# EasyEDA schematic ESP32 Battery Test Dec 2025.json
TITLE: Sheet_1; REV: 1.0; Date: 2025-11-22; Sheet: 1/1; Drawn By: capyvara0; Company: Your Company
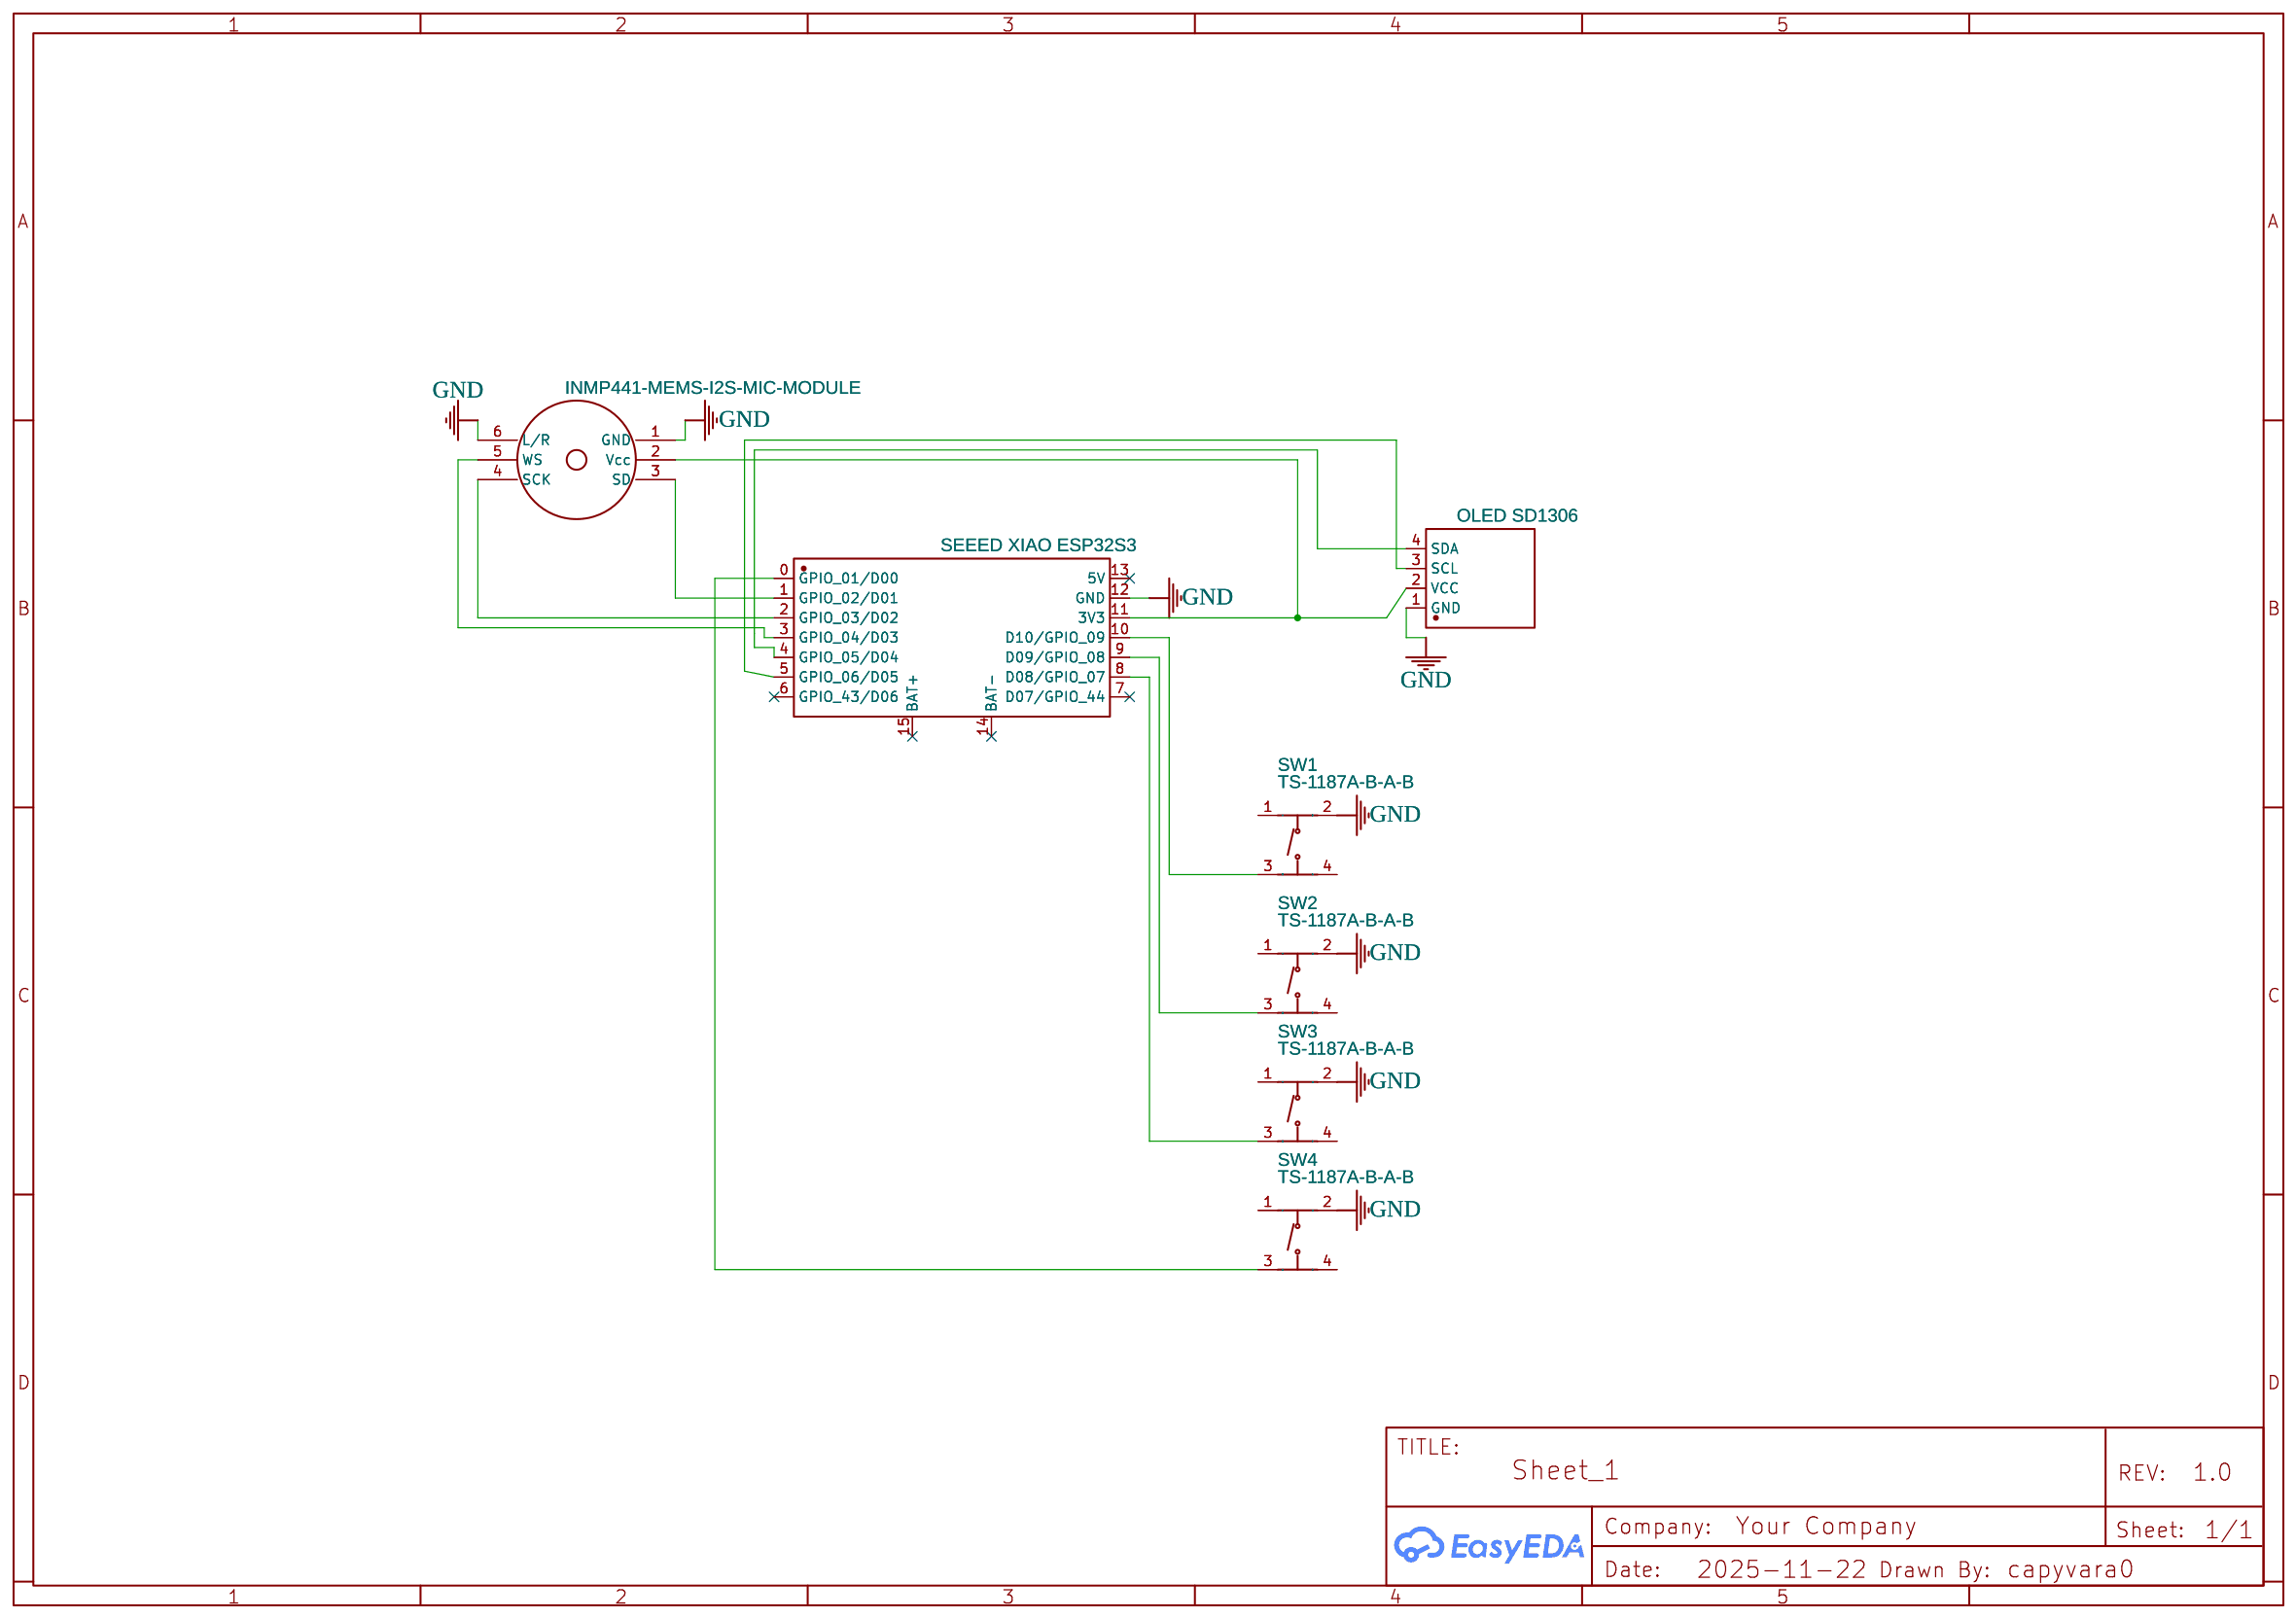
[diagram p0: schematic sheet]

## Parts
SW1  TS-1187A-B-A-B  [SW-SMD_4P-L5.1-W5.1-P3.70-LS6.5-TL_H1.5]
SW2  TS-1187A-B-A-B  [SW-SMD_4P-L5.1-W5.1-P3.70-LS6.5-TL_H1.5]
SW3  TS-1187A-B-A-B  [SW-SMD_4P-L5.1-W5.1-P3.70-LS6.5-TL_H1.5]
SW4  TS-1187A-B-A-B  [SW-SMD_4P-L5.1-W5.1-P3.70-LS6.5-TL_H1.5]
U1  SEEED XIAO ESP32S3  [SEEED STUDIO XIAO_S3 BY LAURENT]
U2  INMP441-MEMS-I2S-MIC-MODULE  [INMP441-MEMS-I2S-MIC-MODULE]
U4  OLED SD1306  [OLED-TH12864]

## Library data of the parts
SW1-SW4 = TS-1187A-B-A-B: Contributor: LCSC; Supplier: LCSC; Supplier Part: C318884; Manufacturer: XKB Connection(中国星坤); JLCPCB Part Class: Basic Part
U1 = SEEED XIAO ESP32S3: Manufacturer: Seeeduino; Manufacturer Part: Xiao; Supplier: Amazon; Contributor: Robert Błaszczak
U2 = INMP441-MEMS-I2S-MIC-MODULE: Supplier: ebay; link: https://www.ebay.de/itm/174127178542; Contributor: fcuce216
U4 = OLED SD1306: Supplier: LCSC; Supplier Part: C9900014198; Manufacturer: null; Manufacturer Part: 1.3寸OLED显示屏12864; link: https://atta.szlcsc.comnull; JLCPCB Part Class: Extended Part; Contributor: Yanko Andrade

## Nets
GND: SW1.2(B) SW2.2(B) SW3.2(B) SW4.2(B) U1.12(GND) U2.1(GND) U2.6(L/R) U4.1(GND)
Net-(SW1-3): SW1.3(C) U1.10(D10/GPIO 09)
Net-(SW2-3): SW2.3(C) U1.9(D09/GPIO 08)
Net-(SW3-3): SW3.3(C) U1.8(D08/GPIO 07)
Net-(SW4-3): SW4.3(C) U1.0(GPIO 01/D00)
Net-(U1-1): U1.1(GPIO 02/D01) U2.3(SD)
Net-(U1-2): U1.2(GPIO 03/D02) U2.4(SCK)
Net-(U1-3): U1.3(GPIO 04/D03) U2.5(WS)
Net-(U1-4): U1.4(GPIO 05/D04) U4.4(SDA)
Net-(U1-5): U1.5(GPIO 06/D05) U4.3(SCL)
Net-(U1-11): U1.11(3V3) U2.2(Vcc) U4.2(VCC)

Not connected (* = marked no-connect by the designer): SW1 1(A) 4(D); SW2 1(A) 4(D); SW3 1(A) 4(D); SW4 1(A) 4(D); U1 6(GPIO 43/D06)* 7(D07/GPIO 44)* 13(5V)* 14(BAT-)* 15(BAT+)*
